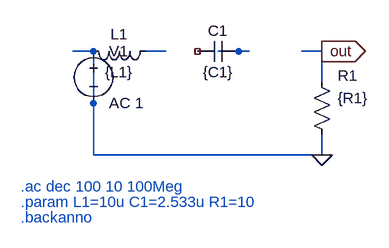
[diagram p0: schematic bandpass_filter.asc]
bandpass_filter.asc, the LTspice schematic file:
Version 4
SHEET 1 880 680
WIRE 80 160 48 160
WIRE 192 160 160 160
WIRE 320 160 272 160
WIRE 432 160 400 160
WIRE 432 208 432 160
WIRE 432 320 432 288
WIRE 80 320 80 160
WIRE 80 320 432 320
SYMBOL voltage 80 144 R0
WINDOW 123 0 0 Left 0
WINDOW 39 0 0 Left 0
SYMATTR InstName V1
SYMATTR Value AC 1
SYMBOL ind 176 144 R90
WINDOW 0 5 56 VBottom 2
WINDOW 3 32 56 VTop 2
SYMATTR InstName L1
SYMATTR Value {L1}
SYMBOL cap 304 144 R90
WINDOW 0 0 32 VBottom 2
WINDOW 3 32 32 VTop 2
SYMATTR InstName C1
SYMATTR Value {C1}
SYMBOL res 416 192 R0
WINDOW 0 40 5 Left 2
WINDOW 3 40 40 Left 2
SYMATTR InstName R1
SYMATTR Value {R1}
FLAG 432 320 0
FLAG 432 160 out
IOPIN 432 160 Out
TEXT -32 368 Left 2 .ac dec 100 10 100Meg
TEXT -32 392 Left 2 .param L1=10u C1=2.533u R1=10
TEXT -32 416 Left 2 .backanno

The netlist it stands for:
* bandpass_filter.asc
V1 0 0 AC 1
L1 N001 0 {L1}
C1 N002 NC_01 {C1}
R1 out 0 {R1}
* .ac dec 100 10 100Meg
* .param L1=10u C1=2.533u R1=10
* .backanno
.backanno
.end